# Altium schematic sheet Power.SchDoc
size A4; SheetNumber: 2; SheetTotal: 8
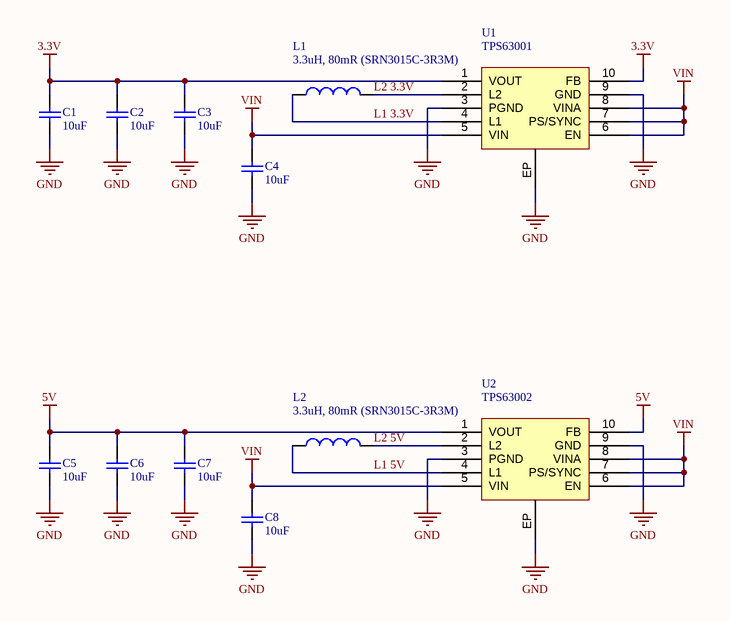
[diagram p0: Power.SchDoc]

## Parts
C1  10uF  [Capacitor 0402]
C2  10uF  [Capacitor 0402]
C3  10uF  [Capacitor 0402]
C4  10uF  [Capacitor 0402]
C5  10uF  [Capacitor 0402]
C6  10uF  [Capacitor 0402]
C7  10uF  [Capacitor 0402]
C8  10uF  [Capacitor 0402]
L1  3.3uH, 80mR (SRN3015C-3R3M)  [SRN3015C]
L2  3.3uH, 80mR (SRN3015C-3R3M)  [SRN3015C]
U1  TPS63001  [WSON-10]
U2  TPS63002  [WSON-10]

## Nets
3.3V: C1.2 C2.2 C3.2 U1.1(VOUT) U1.10(FB)
5V: C5.2 C6.2 C7.2 U2.1(VOUT) U2.10(FB)
GND: C1.1 C2.1 C3.1 C4.1 C5.1 C6.1 C7.1 C8.1 U1.3(PGND) U1.9(GND) U1.EP U2.3(PGND) U2.9(GND) U2.EP
VIN: C4.2 C8.2 U1.5(VIN) U1.6(EN) U1.7(PS/SYNC) U1.8(VINA) U2.5(VIN) U2.6(EN) U2.7(PS/SYNC) U2.8(VINA)
L1 3.3V: L1.1 U1.4(L1)
L1 5V: L2.1 U2.4(L1)
L2 3.3V: L1.2 U1.2(L2)
L2 5V: L2.2 U2.2(L2)

## Notes on the sheet
- TITLE
- SIZE
- A4
- VARIANT
- PROJECT
- SHEET
- VERSION
- OF
- AUTHOR
- DATE

## Library data of the parts
C1-C8 = Capacitor
L1 L2 = Inductor
U1 U2 = TPS630XX